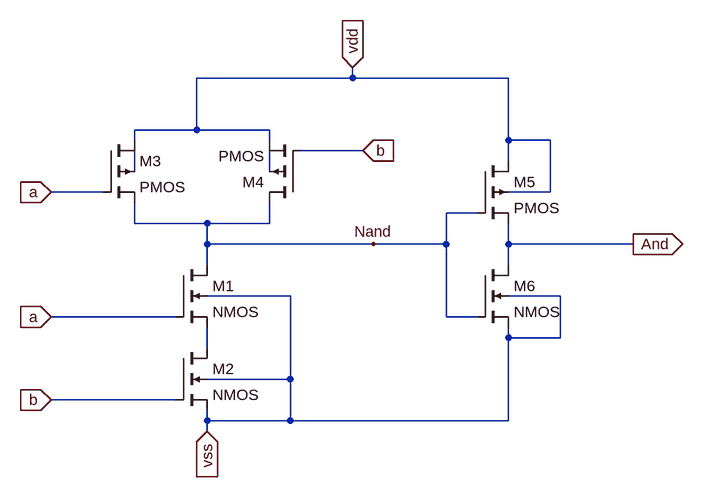
[diagram p0: schematic and.asc]
and.asc, the LTspice schematic file:
Version 4
SHEET 1 1016 680
WIRE 480 -80 480 -96
WIRE 480 -80 240 -80
WIRE 720 -80 480 -80
WIRE 240 0 240 -80
WIRE 240 0 144 0
WIRE 352 0 240 0
WIRE 144 16 144 0
WIRE 352 16 352 0
WIRE 720 16 720 -80
WIRE 784 16 720 16
WIRE 496 32 400 32
WIRE 720 48 720 16
WIRE 144 64 144 32
WIRE 352 64 352 32
WIRE 96 96 16 96
WIRE 784 96 784 16
WIRE 784 96 720 96
WIRE 672 128 624 128
WIRE 144 144 144 112
WIRE 256 144 144 144
WIRE 352 144 352 112
WIRE 352 144 256 144
WIRE 256 176 256 144
WIRE 512 176 256 176
WIRE 624 176 624 128
WIRE 624 176 512 176
WIRE 720 176 720 144
WIRE 912 176 720 176
WIRE 256 208 256 176
WIRE 720 208 720 176
WIRE 384 256 256 256
WIRE 800 256 720 256
WIRE 208 288 16 288
WIRE 624 288 624 176
WIRE 672 288 624 288
WIRE 720 320 720 304
WIRE 800 320 800 256
WIRE 800 320 720 320
WIRE 256 336 256 304
WIRE 384 384 384 256
WIRE 384 384 256 384
WIRE 208 416 16 416
WIRE 256 448 256 432
WIRE 384 448 384 384
WIRE 384 448 256 448
WIRE 720 448 720 320
WIRE 720 448 384 448
WIRE 256 464 256 448
FLAG 512 176 Nand
FLAG 912 176 And
IOPIN 912 176 Out
FLAG 480 -96 vdd
IOPIN 480 -96 In
FLAG 16 96 a
IOPIN 16 96 In
FLAG 496 32 b
IOPIN 496 32 In
FLAG 16 288 a
IOPIN 16 288 In
FLAG 16 416 b
IOPIN 16 416 In
FLAG 256 464 vss
IOPIN 256 464 In
SYMBOL nmos4 208 208 R0
SYMATTR InstName M1
SYMATTR Value2 l=1.8u w=2u
SYMBOL nmos4 208 336 R0
SYMATTR InstName M2
SYMATTR Value2 l=1.8u w=2u
SYMBOL pmos4 96 16 R0
SYMATTR InstName M3
SYMATTR Value2 l=1.18u w=2.18u
SYMBOL pmos4 400 112 R180
SYMATTR InstName M4
SYMATTR Value2 l=1.8u w=2.18u
SYMBOL pmos4 672 48 R0
SYMATTR InstName M5
SYMATTR Value2 l=1.8u w=2.18u
SYMBOL nmos4 672 208 R0
SYMATTR InstName M6
SYMATTR Value2 l=1.8u w=1u

The netlist it stands for:
* and.asc
M1 Nand a N003 vss NMOS l=1.8u w=2u
M2 N003 b vss vss NMOS l=1.8u w=2u
M3 vdd a Nand N001 PMOS l=1.18u w=2.18u
M4 Nand b vdd N002 PMOS l=1.8u w=2.18u
M5 vdd Nand And vdd PMOS l=1.8u w=2.18u
M6 And Nand vss vss NMOS l=1.8u w=1u
.model NMOS NMOS
.model PMOS PMOS
.lib standard.mos
.backanno
.end